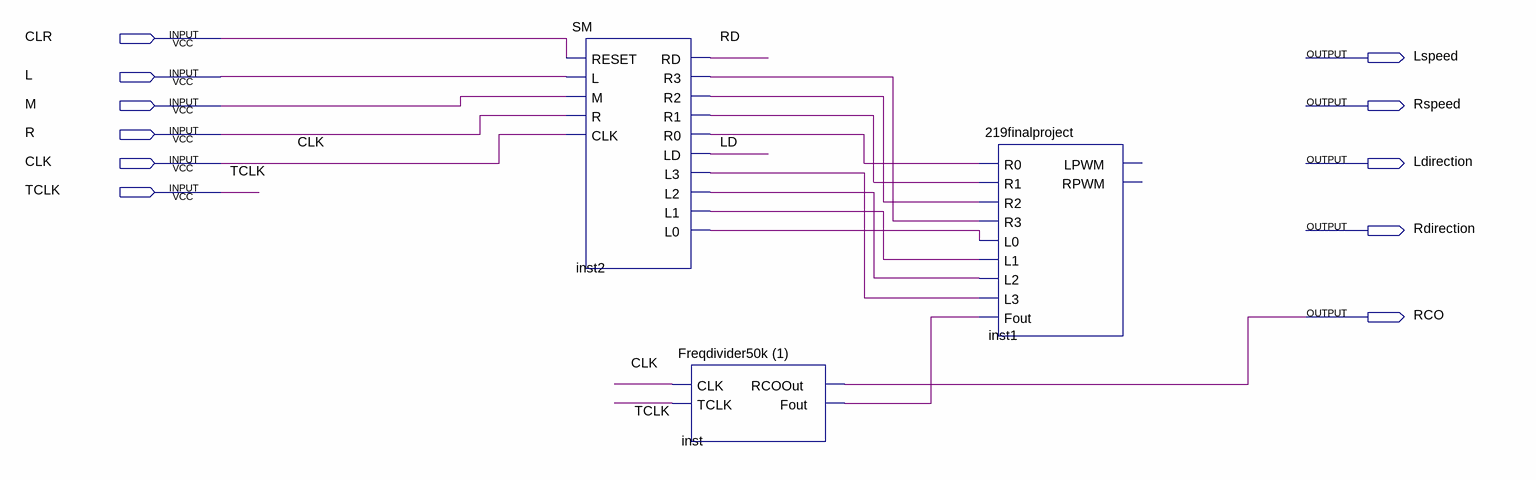
[diagram p0: schematic sheet]
// Quartus schematic Block3.bdf as structural Verilog: 3 symbols, 11 pins
module Block3 (
  input  CLR,
  input  L,
  input  M,
  input  R,
  input  CLK,
  input  TCLK,
  output Lspeed,
  output Rspeed,
  output Ldirection,
  output Rdirection,
  output RCO
);

  wire inst2_l0, inst2_l1, inst2_l2, inst2_l3, inst2_r0, inst2_r1, inst2_r2, inst2_r3, inst_fout, LD, RD;

  SM inst2 (
    .RESET(CLR), .L(L), .M(M), .R(R), .CLK(CLK), .RD(RD), .R3(inst2_r3), .R2(inst2_r2), .R1(inst2_r1),
    .R0(inst2_r0), .LD(LD), .L3(inst2_l3), .L2(inst2_l2), .L1(inst2_l1), .L0(inst2_l0));
  \Freqdivider50k_(1)  inst (.CLK(CLK), .TCLK(TCLK), .RCOOut(RCO), .Fout(inst_fout));
  \219finalproject  inst1 (
    .R0(inst2_r0), .R1(inst2_r1), .R2(inst2_r2), .R3(inst2_r3), .L0(inst2_l0), .L1(inst2_l1), .L2(inst2_l2),
    .L3(inst2_l3), .Fout(inst_fout));  // open: LPWM, RPWM
endmodule
